# EAGLE board A13-OLinuXino-MICRO_Rev_B (EAGLE 6.4), part 1 of 2
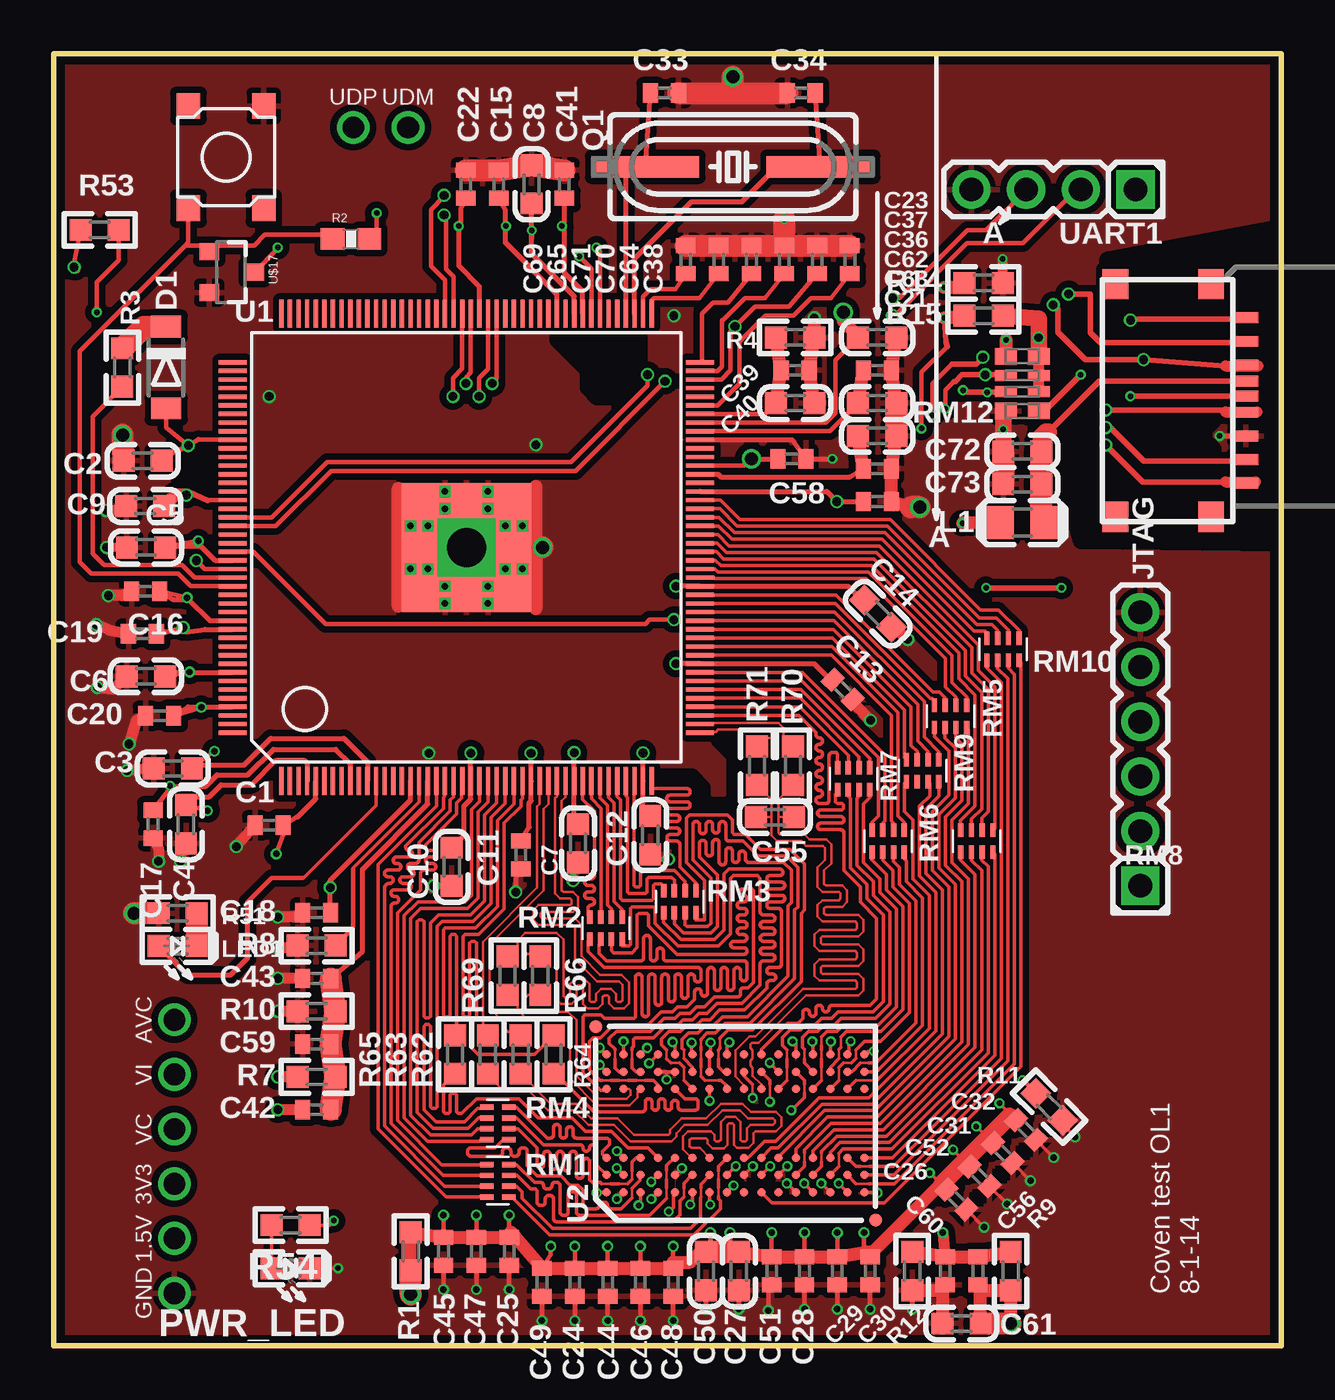
[diagram p3: board, top side]
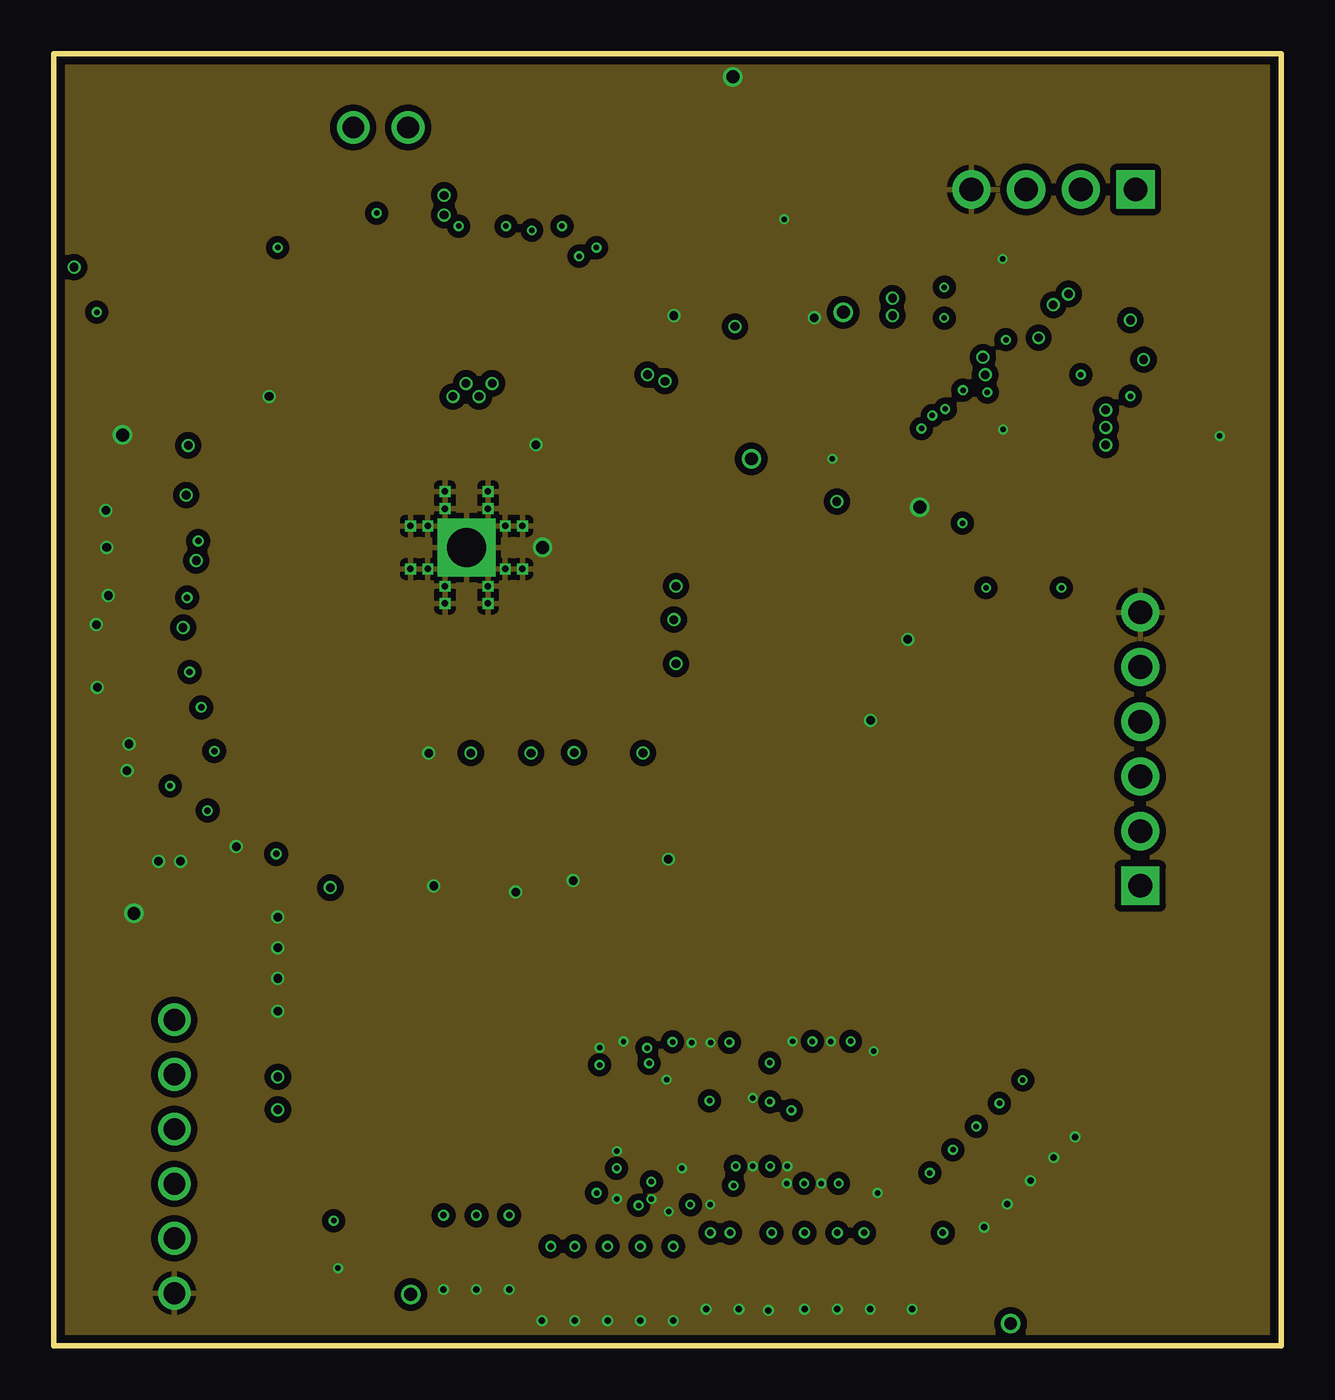
[diagram p4: board, inner layer Route2]
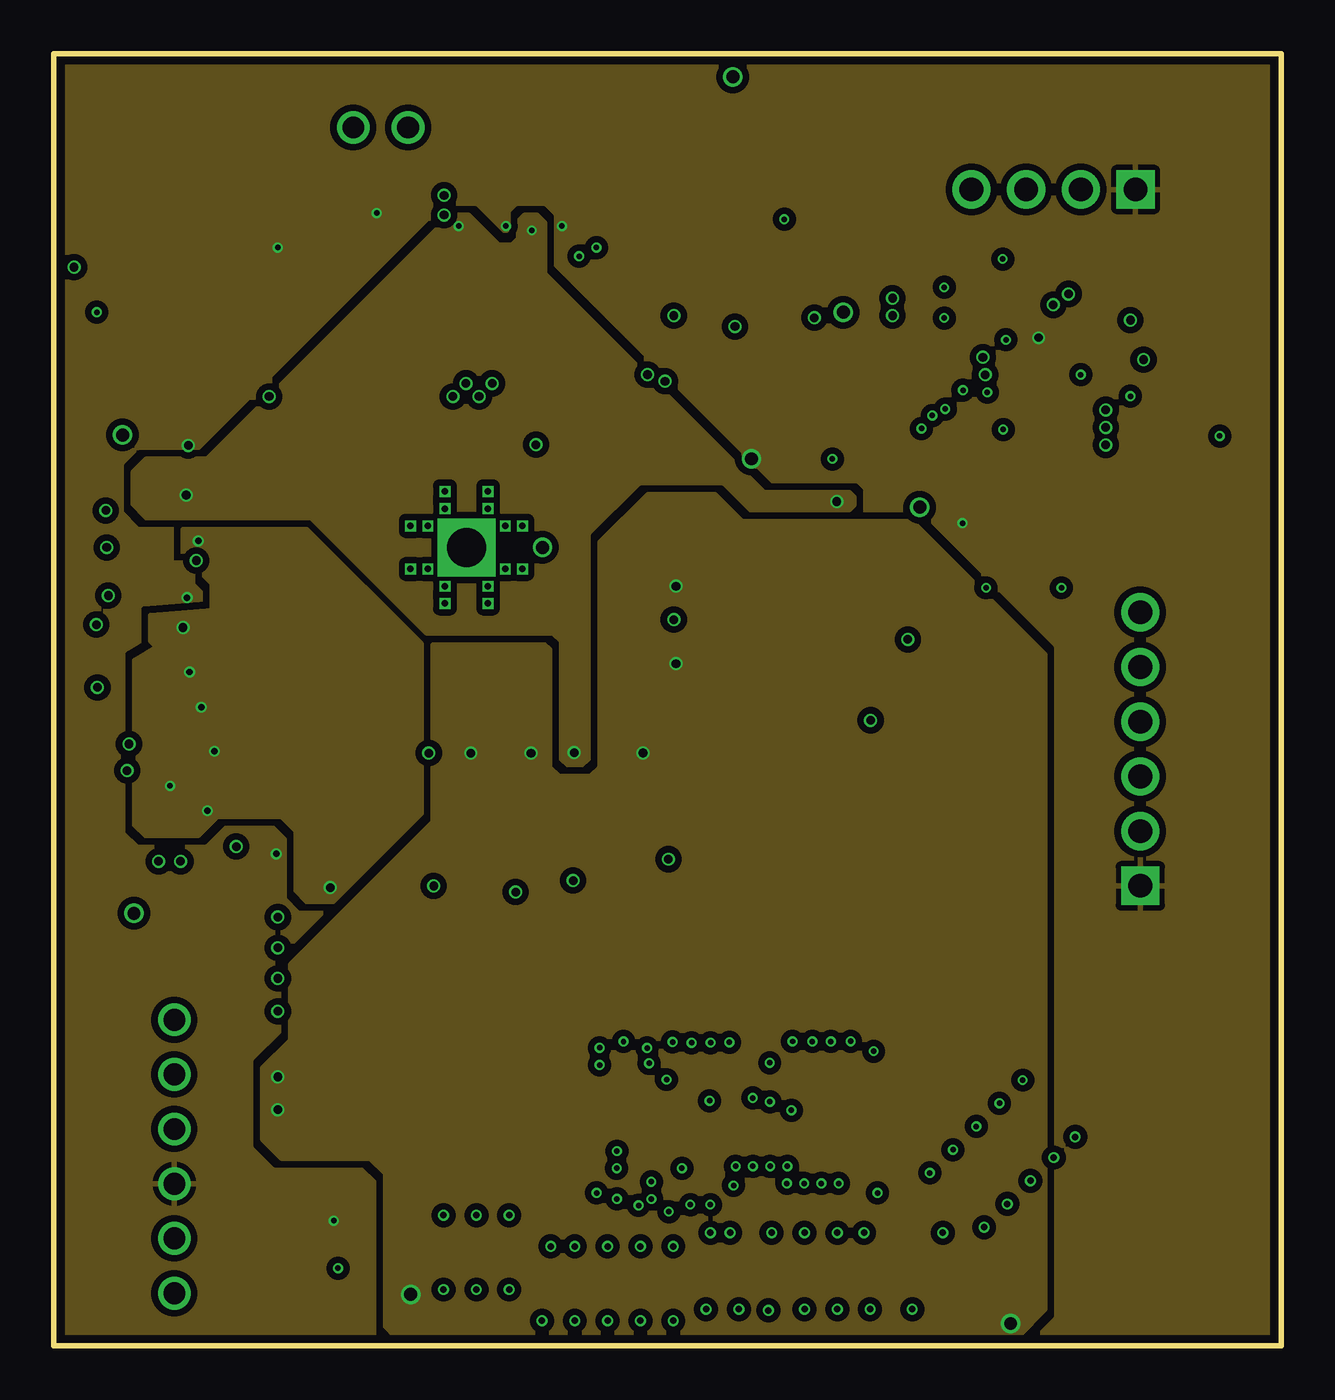
[diagram p5: board, inner layer Route15]
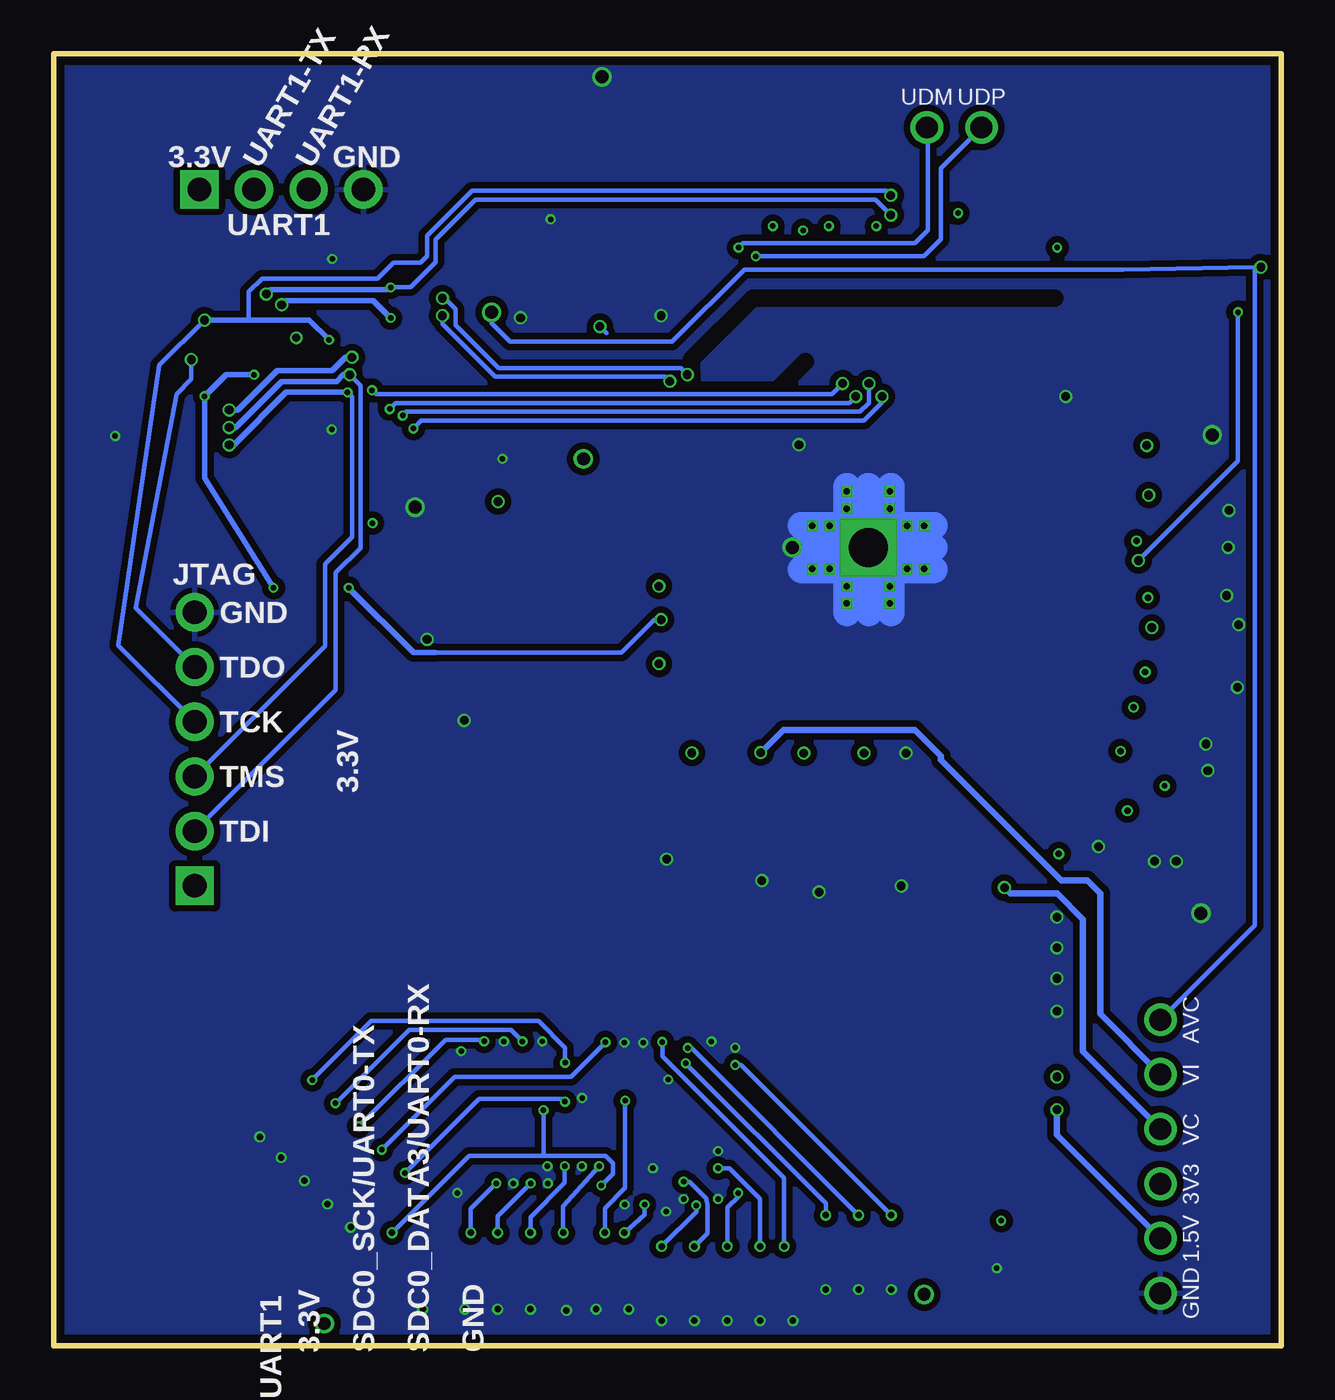
[diagram p6: board, bottom side, seen from below]

Size 57 x 60 mm. Coordinates in mm from the lower left corner, seen from the top.
Outline: 0,60 0,0 57,0 57,60 0,60
Copper layers (1+2*15+16): Top 0.0356mm / dielectric 0.17mm / Route2 0.0178mm / dielectric 1.1941mm / Route15 0.0178mm / dielectric 0.17mm / Bottom 0.0356mm
Design rules "OSHPark_mine_4layer": minimum track width 5mil, minimum drill 10mil, track to track 5mil, track to pad 5mil, pad to pad 5mil, via to via 5mil, smd to smd 5mil, copper to edge 15mil, drill to drill 6mil, minimum pad ring 4mil, minimum via ring 4mil, stop-mask expansion 2mil, vias tented up to drill 13mil, thermal gap 10mil
tRestrict: 25 lines
bRestrict: 7 lines

## Footprints (pad centres in the part's own frame; a part is rotated, then mirrored left to right if it is on the bottom)
C0402 = smd 0.7 x 0.9: 1 -0.65,0; 2 0.65,0
C0603_DWS = smd 1.016 x 1.016: 1 -0.889,0; 2 0.889,0
HOLE_22AWG = drill 1.016: P 0,0
SOD-123 = smd 1 x 1.4: A 1.9,0; C -1.9,0
HN1X6 = drill 1.1 pad 1.778 square: 1 -6.35,0 | drill 1.1 pad 1.778: 2 -3.81,0; 3 -1.27,0; 4 1.27,0; 5 3.81,0; 6 6.35,0
L0805_5MIL_DWS = smd 1.27 x 1.524: 1 -1.016,0; 2 1.016,0
LED-0603 = smd 1.016 x 1.016: A 0.889,0; C -0.889,0
HC49/SMD2_THIN = smd 5 x 1: 1 -4.064,0; 2 4.064,0
0603_0R = smd 1.016 x 1.016: 1 -0.889,0; 2 0.889,0
0603-RES = smd 1.1 x 1: 1 -0.85,0; 2 0.85,0
R0603_5MIL_DWS = smd 1.016 x 1.016: 1 -0.889,0; 2 0.889,0
R_MATRIX_4_0402_25X625 = smd 0.625 x 0.25: 1.1 -0.512,0.75; 1.2 0.512,0.75; 2.1 -0.512,0.25; 2.2 0.512,0.25; 3.1 -0.512,-0.25; 3.2 0.512,-0.25; 4.1 -0.512,-0.75; 4.2 0.512,-0.75
R_MATRIX_4 = smd 1.016 x 0.762: 1.1 -0.762,1.27; 1.2 0.762,1.27; 4.1 -0.762,-1.27; 4.2 0.762,-1.27 | smd 1.016 x 0.508: 2.1 -0.762,0.381; 2.2 0.762,0.381; 3.1 -0.762,-0.381; 3.2 0.762,-0.381
TAC_SWITCH_SMD_4.5X4.5 = smd 1.2 x 1.1: 1 -2.375,1.75; 2 2.375,1.75; 3 -2.375,-1.75; 4 2.375,-1.75
TQFP176 = smd 0.2 x 1.3: 1 -8.6,-10.85; 2 -8.2,-10.85; 3 -7.8,-10.85; 4 -7.4,-10.85; 5 -7,-10.85; 6 -6.6,-10.85; 7 -6.2,-10.85; 8 -5.8,-10.85; 9 -5.4,-10.85; 10 -5,-10.85; 11 -4.6,-10.85; 12 -4.2,-10.85; 13 -3.8,-10.85; 14 -3.4,-10.85; 15 -3,-10.85; 16 -2.6,-10.85; 17 -2.2,-10.85; 18 -1.8,-10.85; 19 -1.4,-10.85; 20 -1,-10.85; 21 -0.6,-10.85; 22 -0.2,-10.85; 23 0.2,-10.85; 24 0.6,-10.85; 25 1,-10.85; 26 1.4,-10.85; 27 1.8,-10.85; 28 2.2,-10.85; 29 2.6,-10.85; 30 3,-10.85; 31 3.4,-10.85; 32 3.8,-10.85; 33 4.2,-10.85; 34 4.6,-10.85; 35 5,-10.85; 36 5.4,-10.85; 37 5.8,-10.85; 38 6.2,-10.85; 39 6.6,-10.85; 40 7,-10.85; 41 7.4,-10.85; 42 7.8,-10.85; 43 8.2,-10.85; 44 8.6,-10.85; 89 8.6,10.85; 90 8.2,10.85; 91 7.8,10.85; 92 7.4,10.85; 93 7,10.85; 94 6.6,10.85; 95 6.2,10.85; 96 5.8,10.85; 97 5.4,10.85; 98 5,10.85; 99 4.6,10.85; 100 4.2,10.85; 101 3.8,10.85; 102 3.4,10.85; 103 3,10.85; 104 2.6,10.85; 105 2.2,10.85; 106 1.8,10.85; 107 1.4,10.85; 108 1,10.85; 109 0.6,10.85; 110 0.2,10.85; 111 -0.2,10.85; 112 -0.6,10.85; 113 -1,10.85; 114 -1.4,10.85; 115 -1.8,10.85; 116 -2.2,10.85; 117 -2.6,10.85; 118 -3,10.85; 119 -3.4,10.85; 120 -3.8,10.85; 121 -4.2,10.85; 122 -4.6,10.85; 123 -5,10.85; 124 -5.4,10.85; 125 -5.8,10.85; 126 -6.2,10.85; 127 -6.6,10.85; 128 -7,10.85; 129 -7.4,10.85; 130 -7.8,10.85; 131 -8.2,10.85; 132 -8.6,10.85 | smd 1.3 x 0.2: 45 10.85,-8.6; 46 10.85,-8.2; 47 10.85,-7.8; 48 10.85,-7.4; 49 10.85,-7; 50 10.85,-6.6; 51 10.85,-6.2; 52 10.85,-5.8; 53 10.85,-5.4; 54 10.85,-5; 55 10.85,-4.6; 56 10.85,-4.2; 57 10.85,-3.8; 58 10.85,-3.4; 59 10.85,-3; 60 10.85,-2.6; 61 10.85,-2.2; 62 10.85,-1.8; 63 10.85,-1.4; 64 10.85,-1; 65 10.85,-0.6; 66 10.85,-0.2; 67 10.85,0.2; 68 10.85,0.6; 69 10.85,1; 70 10.85,1.4; 71 10.85,1.8; 72 10.85,2.2; 73 10.85,2.6; 74 10.85,3; 75 10.85,3.4; 76 10.85,3.8; 77 10.85,4.2; 78 10.85,4.6; 79 10.85,5; 80 10.85,5.4; 81 10.85,5.8; 82 10.85,6.2; 83 10.85,6.6; 84 10.85,7; 85 10.85,7.4; 86 10.85,7.8; 87 10.85,8.2; 88 10.85,8.6; 133 -10.85,8.6; 134 -10.85,8.2; 135 -10.85,7.8; 136 -10.85,7.4; 137 -10.85,7; 138 -10.85,6.6; 139 -10.85,6.2; 140 -10.85,5.8; 141 -10.85,5.4; 142 -10.85,5; 143 -10.85,4.6; 144 -10.85,4.2; 145 -10.85,3.8; 146 -10.85,3.4; 147 -10.85,3; 148 -10.85,2.6; 149 -10.85,2.2; 150 -10.85,1.8; 151 -10.85,1.4; 152 -10.85,1; 153 -10.85,0.6; 154 -10.85,0.2; 155 -10.85,-0.2; 156 -10.85,-0.6; 157 -10.85,-1; 158 -10.85,-1.4; 159 -10.85,-1.8; 160 -10.85,-2.2; 161 -10.85,-2.6; 162 -10.85,-3; 163 -10.85,-3.4; 164 -10.85,-3.8; 165 -10.85,-4.2; 166 -10.85,-4.6; 167 -10.85,-5; 168 -10.85,-5.4; 169 -10.85,-5.8; 170 -10.85,-6.2; 171 -10.85,-6.6; 172 -10.85,-7; 173 -10.85,-7.4; 174 -10.85,-7.8; 175 -10.85,-8.2; 176 -10.85,-8.6 | smd 6 x 6: GND_PAD 0,0 | drill 1.8 pad 2.184 square: P$2 0,0 | drill 0.3 pad 0.406 square: P$3 -2.6,-1; P$4 -1.8,-1; P$5 -1,-2.6; P$6 -1,-1.8; P$7 1,-2.6; P$8 1,-1.8; P$9 2.6,-1; P$10 1.8,-1; P$11 -2.6,1; P$12 -1.8,1; P$13 2.6,1; P$14 1.8,1; P$15 -1,2.6; P$16 -1,1.8; P$17 1,2.6; P$18 1,1.8
FBGA96 = smd 0.4 x 0.4: A1 -3.2,6; A2 -2.4,6; A3 -1.6,6; A7 1.6,6; A8 2.4,6; A9 3.2,6; B1 -3.2,5.2; B2 -2.4,5.2; B3 -1.6,5.2; B7 1.6,5.2; B8 2.4,5.2; B9 3.2,5.2; C1 -3.2,4.4; C2 -2.4,4.4; C3 -1.6,4.4; C7 1.6,4.4; C8 2.4,4.4; C9 3.2,4.4; D1 -3.2,3.6; D2 -2.4,3.6; D3 -1.6,3.6; D7 1.6,3.6; D8 2.4,3.6; D9 3.2,3.6; E1 -3.2,2.8; E2 -2.4,2.8; E3 -1.6,2.8; E7 1.6,2.8; E8 2.4,2.8; E9 3.2,2.8; F1 -3.2,2; F2 -2.4,2; F3 -1.6,2; F7 1.6,2; F8 2.4,2; F9 3.2,2; G1 -3.2,1.2; G2 -2.4,1.2; G3 -1.6,1.2; G7 1.6,1.2; G8 2.4,1.2; G9 3.2,1.2; H1 -3.2,0.4; H2 -2.4,0.4; H3 -1.6,0.4; H7 1.6,0.4; H8 2.4,0.4; H9 3.2,0.4; J1 -3.2,-0.4; J2 -2.4,-0.4; J3 -1.6,-0.4; J7 1.6,-0.4; J8 2.4,-0.4; J9 3.2,-0.4; K1 -3.2,-1.2; K2 -2.4,-1.2; K3 -1.6,-1.2; K7 1.6,-1.2; K8 2.4,-1.2; K9 3.2,-1.2; L1 -3.2,-2; L2 -2.4,-2; L3 -1.6,-2; L7 1.6,-2; L8 2.4,-2; L9 3.2,-2; M1 -3.2,-2.8; M2 -2.4,-2.8; M3 -1.6,-2.8; M7 1.6,-2.8; M8 2.4,-2.8; M9 3.2,-2.8; N1 -3.2,-3.6; N2 -2.4,-3.6; N3 -1.6,-3.6; N7 1.6,-3.6; N8 2.4,-3.6; N9 3.2,-3.6; P1 -3.2,-4.4; P2 -2.4,-4.4; P3 -1.6,-4.4; P7 1.6,-4.4; P8 2.4,-4.4; P9 3.2,-4.4; R1 -3.2,-5.2; R2 -2.4,-5.2; R3 -1.6,-5.2; R7 1.6,-5.2; R8 2.4,-5.2; R9 3.2,-5.2; T1 -3.2,-6; T2 -2.4,-6; T3 -1.6,-6; T7 1.6,-6; T8 2.4,-6; T9 3.2,-6 | smd 0.6 x 0.6: FID1 -4.5,-6.5; FID2 4.5,6.5
MICROSD-MOLEX-1050270001 = smd 0.5 x 1.2: G1 0.2,-6.65; P1 3.85,-6.65; P2 2.75,-6.65; P3 1.65,-6.65; P4 0.9,-6.65; P5 -0.55,-6.65; P6 -1.65,-6.65; P7 -2.75,-6.65; P8 -3.85,-6.65 | smd 1.4 x 1.2: SHELL1 -5.4,-0.6; SHELL2 5.4,-0.6; SHELL3 5.4,-5.05; SHELL4 -5.4,-5.05
SOT23-3 = smd 0.8 x 0.9: 1 -0.95,-1; 2 0.95,-1; 3 0,1.1
HN1X4 = drill 1.1 pad 1.778 square: 1 -3.81,0 | drill 1.1 pad 1.778: 2 -1.27,0; 3 1.27,0; 4 3.81,0

## Placement (x,y rotation side)
C1  100nF  [C0402]  10,24.17 0 top
C2  22uF/6.3V  [C0603_DWS]  4.13,41.1 0 top
C3  22uF/6.3V  [C0603_DWS]  5.53,26.81 0 top
C4  10uF/6.3V  [C0603_DWS]  6.14,24.22 90 top
C5  10uF/6.3V  [C0603_DWS]  4.28,37.07 0 top
C6  10uF/6.3V  [C0603_DWS]  4.28,31.09 0 top
C7  22uF/6.3V  [C0603_DWS]  24.35,23.33 90 top
C8  10uF/6.3V  [C0603_DWS]  22.19,53.94 270 top
C9  10uF/6.3V  [C0603_DWS]  4.24,39 0 top
C10  22uF/6.3V  [C0603_DWS]  18.48,22.24 90 top
C11  100nF  [C0402]  21.68,22.8 90 top
C12  10uF/6.3V  [C0603_DWS]  27.7,23.71 90 top
C13  100nF  [C0402]  36.64,30.47 135 top
C14  10uF/6.3V  [C0603_DWS]  38.27,34 135 top
C15  100nF  [C0402]  20.67,53.94 270 top
C16  100nF  [C0402]  4.26,35.04 0 top
C17  100nF  [C0402]  4.61,24.22 90 top
C18  100nF  [C0402]  12.21,20.11 0 top
C19  100nF  [C0402]  4.12,33.06 0 top
C20  100nF  [C0402]  4.92,29.25 0 top
C21  100nF  [C0402]  38.24,39.21 180 top
C22  100nF  [C0402]  19.14,53.94 270 top
C23  22uF/6.3V  [C0603_DWS]  38.24,46.83 180 top
C24  100nF  [C0402]  24.2,2.94 270 top
C25  100nF  [C0402]  21.15,4.38 270 top
C26  100nF  [C0402]  41.92,6.79 315 top
C27  22uF/6.3V  [C0603_DWS]  31.82,3.47 270 top
C28  100nF  [C0402]  34.87,3.47 270 top
C29  100nF  [C0402]  36.39,3.47 270 top
C30  100nF  [C0402]  37.91,3.47 270 top
C31  100nF  [C0402]  44.08,8.94 315 top
C32  100nF  [C0402]  45.16,10.02 315 top
C33  33pF  [C0402]  28.36,58.18 180 top
C34  33pF  [C0402]  34.71,58.18 0 top
C36  10uF/6.3V  [C0603_DWS]  38.24,43.78 180 top
C37  100nF  [C0402]  38.24,45.3 180 top
C38  1uF  [C0402]  36.97,50.43 270 top
C39  100nF  [C0402]  34.43,45.3 180 top
C40  10uF/6.3V  [C0603_DWS]  34.43,43.78 180 top
C41  100nF  [C0402]  23.71,53.94 270 top
C42  100nF  [C0402]  12.21,10.96 0 top
C43  100nF  [C0402]  12.21,17.06 0 top
C44  100nF  [C0402]  25.72,2.94 270 top
C45  100nF  [C0402]  18.1,4.38 270 top
C46  100nF  [C0402]  27.24,2.94 270 top
C47  100nF  [C0402]  19.62,4.38 270 top
C48  100nF  [C0402]  28.77,2.94 270 top
C49  100nF  [C0402]  22.67,2.94 270 top
C50  22uF/6.3V  [C0603_DWS]  30.29,3.47 270 top
C51  100nF  [C0402]  33.34,3.47 270 top
C52  100nF  [C0402]  43,7.87 315 top
C55  NA  [C0603_DWS]  33.49,24.55 0 top
C56  100nF  [C0402]  42.92,3.47 90 top
C58  100nF  [C0402]  34.28,41.19 180 top
C59  100nF  [C0402]  12.21,14.01 0 top
C60  100nF  [C0402]  41.39,3.47 90 top
C61  NA(22uF/6.3V)  [C0603_DWS]  42.15,1.03 0 top
C62  10uF/6.3V  [C0603_DWS]  38.24,42.25 180 top
C63  100nF  [C0402]  38.24,40.73 180 top
C64  1nF  [C0402]  35.45,50.43 270 top
C65  1nF  [C0402]  30.88,50.43 270 top
C69  1nF  [C0402]  29.35,50.43 270 top
C70  1nF  [C0402]  33.93,50.43 270 top
C71  1nF  [C0402]  32.4,50.43 270 top
C72  22uF/6.3V  [C0603_DWS]  44.98,41.53 0 top
C73  22uF/6.3V  [C0603_DWS]  44.98,40.01 0 top
CONN1  VI  [HOLE_22AWG]  5.6,12.6 270 top
CONN2  1.5V  [HOLE_22AWG]  5.6,4.98 270 top
CONN3  GND  [HOLE_22AWG]  5.6,2.44 270 top
CONN4  VC  [HOLE_22AWG]  5.6,10.06 270 top
CONN5  3V3  [HOLE_22AWG]  5.6,7.52 270 top
CONN6  AVC  [HOLE_22AWG]  5.6,15.14 270 top
CONN7  UDM  [HOLE_22AWG]  16.45,56.58 180 top
CONN8  UDP  [HOLE_22AWG]  13.91,56.58 180 top
D1  1N5819(S4SOD-123)  [SOD-123]  5.22,45.43 270 top
JTAG  NA(HN1X6)  [HN1X6]  50.46,27.71 90 top
L1  CL470nH/0805/1.76R/250mA  [L0805_5MIL_DWS]  44.98,38.23 0 top
LED1  LED/GREEN/0603  [LED-0603]  5.75,18.56 180 top
PWR_LED  LED/RED/0603  [LED-0603]  11,3.6 180 top
Q1  Q24.000MHz/HC-49SM/SMD/20ppm/20pF  [HC49/SMD2_THIN]  31.54,54.75 180 top
R1  0R(Board_Mounted)  [0603_0R]  16.58,4.38 90 top
R2  [0603-RES]  13.8,51.4 0 top
R3  47k  [R0603_5MIL_DWS]  3.18,45.43 90 top
R4  200k/1%  [R0603_5MIL_DWS]  34.43,46.83 0 top
R7  2k/1%  [R0603_5MIL_DWS]  12.21,12.49 180 top
R8  240R/1%  [R0603_5MIL_DWS]  12.21,18.58 0 top
R9  1k/1%  [R0603_5MIL_DWS]  44.44,3.47 270 top
R10  2k/1%  [R0603_5MIL_DWS]  12.21,15.53 0 top
R11  240R/1%  [R0603_5MIL_DWS]  46.23,11.1 135 top
R12  1k/1%  [R0603_5MIL_DWS]  39.87,3.47 90 top
R14  NA(1M)  [R0603_5MIL_DWS]  43.18,49.36 0 top
R15  10k  [R0603_5MIL_DWS]  43.18,47.83 0 top
R51  2.2k  [R0603_5MIL_DWS]  5.75,20.09 0 top
R53  100k/1%  [R0603_5MIL_DWS]  2.13,51.82 0 top
R54  2.2k  [R0603_5MIL_DWS]  11,5.6 180 top
R62  22R  [R0603_5MIL_DWS]  21.68,13.53 90 top
R63  22R  [R0603_5MIL_DWS]  20.16,13.53 90 top
R64  22R  [R0603_5MIL_DWS]  23.21,13.53 90 top
R65  22R  [R0603_5MIL_DWS]  18.63,13.53 90 top
R66  22R  [R0603_5MIL_DWS]  22.6,17.18 90 top
R69  22R  [R0603_5MIL_DWS]  21.07,17.18 90 top
R70  22R  [R0603_5MIL_DWS]  34.33,26.94 90 top
R71  22R  [R0603_5MIL_DWS]  32.66,26.94 90 top
RM1  RA0805_(4X0402)_22R  [R_MATRIX_4_0402_25X625]  20.62,7.66 0 top
RM2  RA0805_(4X0402)_22R  [R_MATRIX_4_0402_25X625]  25.64,19.39 270 top
RM3  RA0805_(4X0402)_22R  [R_MATRIX_4_0402_25X625]  29.07,20.61 270 top
RM4  RA0805_(4X0402)_22R  [R_MATRIX_4_0402_25X625]  20.62,10.33 0 top
RM5  RA0805_(4X0402)_22R  [R_MATRIX_4_0402_25X625]  41.65,29.22 270 top
RM6  RA0805_(4X0402)_22R  [R_MATRIX_4_0402_25X625]  38.75,23.43 270 top
RM7  RA0805_(4X0402)_22R  [R_MATRIX_4_0402_25X625]  37.15,26.33 270 top
RM8  RA0805_(4X0402)_22R  [R_MATRIX_4_0402_25X625]  42.87,23.43 270 top
RM9  RA0805_(4X0402)_22R  [R_MATRIX_4_0402_25X625]  40.35,26.71 270 top
RM10  RA0805_(4X0402)_22R  [R_MATRIX_4_0402_25X625]  44.09,32.35 270 top
RM12  RA1206_(4X0603)_4B8_100K  [R_MATRIX_4]  44.98,44.68 0 top
S_RESET  TAC_SWITCHSMD_4.5X4.5  [TAC_SWITCH_SMD_4.5X4.5]  8,55.2 270 top
U1  A13  [TQFP176]  19.17,37.07 0 top
U2  H5TQ2G63BFR  [FBGA96]  31.66,10.33 90 top
U$6  [MICROSD-MOLEX-1050270001]  48.7,43.9 90 top
U$17  RT9818C-29GV  [SOT23-3]  8.22,49.86 270 top
UART1  HN1X4  [HN1X4]  46.43,53.7 180 top